# Altium schematic sheet imu.SchDoc
size A4; SheetNumber: 6; SheetTotal: 8
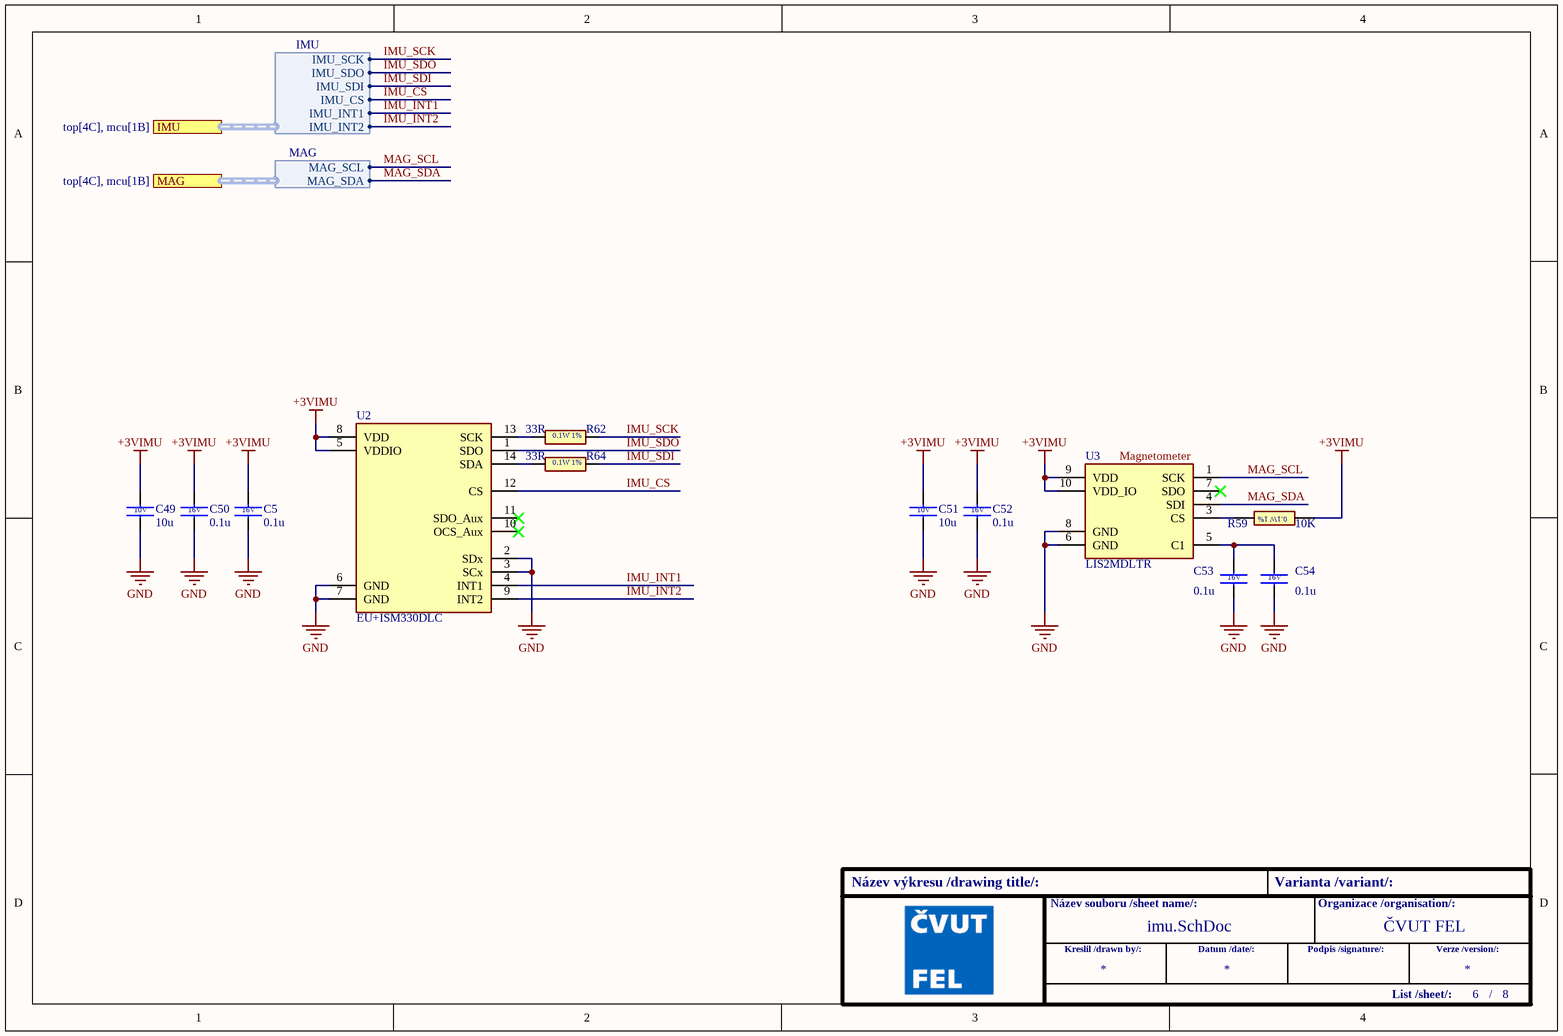
[diagram p0: imu.SchDoc]

## Parts
C5  0.1u  [CAPC1608X95N]
C49  10u  [C0603]
C50  0.1u  [CAPC1608X95N]
C51  10u  [C0603]
C52  0.1u  [CAPC1608X95N]
C53  0.1u  [CAPC1608X95N]
C54  0.1u  [CAPC1608X95N]
R59  10K  [RESC1608X50N]
R62  33R  [RESC1608X55N]
R64  33R  [RESC1608X55N]
U2  EU+ISM330DLC  [LGA-14_1]
U3  LIS2MDLTR  [LGA-12]

## Ports
IMU (harness IMU, see top[4C], mcu[1B]), MAG (harness MAG, see top[4C], mcu[1B])

## Harnesses
IMU: IMU_INT2, IMU_INT1, IMU_CS, IMU_SDI, IMU_SDO, IMU_SCK
MAG: MAG_SCL, MAG_SDA

## Nets
+3VIMU: C5.1 C49.1 C50.1 C51.1 C52.1 R59.1 U2.5(VDDIO) U2.8(VDD) U3.9(VDD) U3.10(VDD_IO)
GND: C5.2 C49.2 C50.2 C51.2 C52.2 C53.2 C54.2 U2.2(SDx) U2.3(SCx) U2.6(GND) U2.7(GND) U3.6(GND) U3.8(GND)
IMU_CS: U2.12(CS) ; port IMU.IMU_CS
IMU_INT1: U2.4(INT1) ; port IMU.IMU_INT1
IMU_INT2: U2.9(INT2) ; port IMU.IMU_INT2
IMU_SCK: R62.2 ; port IMU.IMU_SCK
IMU_SDI: R64.2 ; port IMU.IMU_SDI
IMU_SDO: U2.1(SDO) ; port IMU.IMU_SDO
MAG_SCL: U3.1(SCK) ; port MAG.MAG_SCL
MAG_SDA: U3.4(SDI) ; port MAG.MAG_SDA
NetC53_1: C53.1 C54.1 U3.5(C1)
NetR59_2: R59.2 U3.3(CS)
NetR62_1: R62.1 U2.13(SCK)
NetR64_1: R64.1 U2.14(SDA)

Not connected (* = marked no-connect by the designer): U2 10(OCS_Aux)* 11(SDO_Aux)*; U3 7(SDO)*

## Notes on the sheet
- (near U3) Magnetometer
- Název výkresu /drawing title/:
- Název souboru /sheet name/:
- Varianta /variant/:
- Organizace /organisation/:
- ČVUT FEL
- Kreslil /drawn by/:
- Datum /date/:
- Podpis /signature/:
- List /sheet/:
- Verze /version/:
- /
- (in symbol ECK+10u10V) 10V
- (in symbol ECK+100n16V) 16V
- (in symbol ER+10K) 0.1W 1%
- (in symbol ER+33R) 0.1W 1%

## Library data of the parts
C5 C50 C52-C54 = ECK+100n16V: 16V 0.1uF XR7 0603 10%; Manufacturer_Name: KEMET; Manufacturer_Part_Number: C0603C104K4RAC-TU; Datasheet Link: https://connect.kemet.com:7667/gateway/IntelliData-ComponentDocumentation/1.0/download/specsheet/C0603C104K4RACTU; Height: 0.95mm; Mouser Part Number: 80-C0603C104K4RAC; Arrow Part Number: C0603C104K4RAC-TU; Arrow Price/Stock: https://www.arrow.com/en/products/c0603c104k4ractu/kemet-corporation
C49 C51 = ECK+10u10V: 10 VDC, 20 %, X5R; Manufacturer_Name: KEMET; Manufacturer_Part_Number: C0603C106M8PACTU; Datasheet Link: https://content.kemet.com/datasheets/KEM_C1006_X5R_SMD.pdf; Height: 0.87mm; Mouser Part Number: 80-C0603C106M8PACTU; Mouser Price/Stock: https://www.mouser.co.uk/ProductDetail/KEMET/C0603C106M8PACTU?qs=gt1LBUVyoHk6B7S%252BOYJa0A%3D%3D; Arrow Part Number: C0603C106M8PACTU; Arrow Price/Stock: https://www.arrow.com/en/products/c0603c106m8pactu/kemet-corporation?region=nac
R59 = ER+10K: Resistor 1%, 0.1W; Manufacturer_Name: Vishay; Manufacturer_Part_Number: CRCW060310K0FKEA; Datasheet Link: http://www.vishay.com/docs/20035/dcrcwe3.pdf; Height: 0.5mm; Mouser Part Number: 71-CRCW0603-10K-E3; Mouser Price/Stock: https://www.mouser.co.uk/ProductDetail/Vishay-Dale/CRCW060310K0FKEA?qs=pAO1Z172M84BVnhDjtnsoQ%3D%3D; Arrow Part Number: CRCW060310K0FKEA; Arrow Price/Stock: https://www.arrow.com/en/products/crcw060310k0fkea/vishay?region=europe
R62 R64 = ER+33R: Resistor 1% 0.1W; Manufacturer_Name: ROYALOHM; Manufacturer_Part_Number: 0603WAF330JT5E; Datasheet Link: https://datasheet.lcsc.com/lcsc/2206010116_UNI-ROYAL-Uniroyal-Elec-0603WAF330JT5E_C23140.pdf; Height: 0.55mm; Mouser Part Number: 303-0603WAF330JT5E; Mouser Price/Stock: https://www.mouser.co.uk/ProductDetail/Royalohm/0603WAF330JT5E?qs=e8oIoAS2J1RitKiKgULsBA%3D%3D
U2 = EU+ISM330DLC: ISM330DLCTR iNEMO 6-axis IMU: 3-axis accelerometer and 3-axis gyroscope with digital output; Manufacturer_Name: STMicroelectronics; Datasheet Link: https://www.st.com/resource/en/datasheet/ism330dlc.pdf; Manufacturer_Part_Number: ISM330DLCTR; Mouser Part Number: 511-ISM330DLCTR; Mouser Price/Stock: https://www.mouser.co.uk/ProductDetail/STMicroelectronics/ISM330DLCTR?qs=HXFqYaX1Q2xJsRh9qTmUlw%3D%3D; Arrow Part Number: ISM330DLCTR; Arrow Price/Stock: https://www.arrow.com/en/products/ism330dlctr/stmicroelectronics.html?utm_currency=USD&region=nac
U3 = EU+LIS2MDLTR: Magnetic Sensors Digital output magnetic sensor: ultralow-power, high-performance 3-axis magnetom; Manufacturer_Name: STMicroelectronics; Datasheet Link: https://www.st.com/resource/en/datasheet/lis2mdl.pdf; Manufacturer_Part_Number: LIS2MDLTR; Mouser Part Number: 511-LIS2MDLTR; Mouser Price/Stock: https://www.mouser.co.uk/ProductDetail/STMicroelectronics/LIS2MDLTR?qs=5aG0NVq1C4wS0n6b5NiBNQ%3D%3D; Arrow Part Number: LIS2MDLTR; Arrow Price/Stock: https://www.arrow.com/en/products/lis2mdltr/stmicroelectronics?utm_currency=USD&region=nac